# EAGLE design 684-plant-watering (EAGLE 7.4.0)
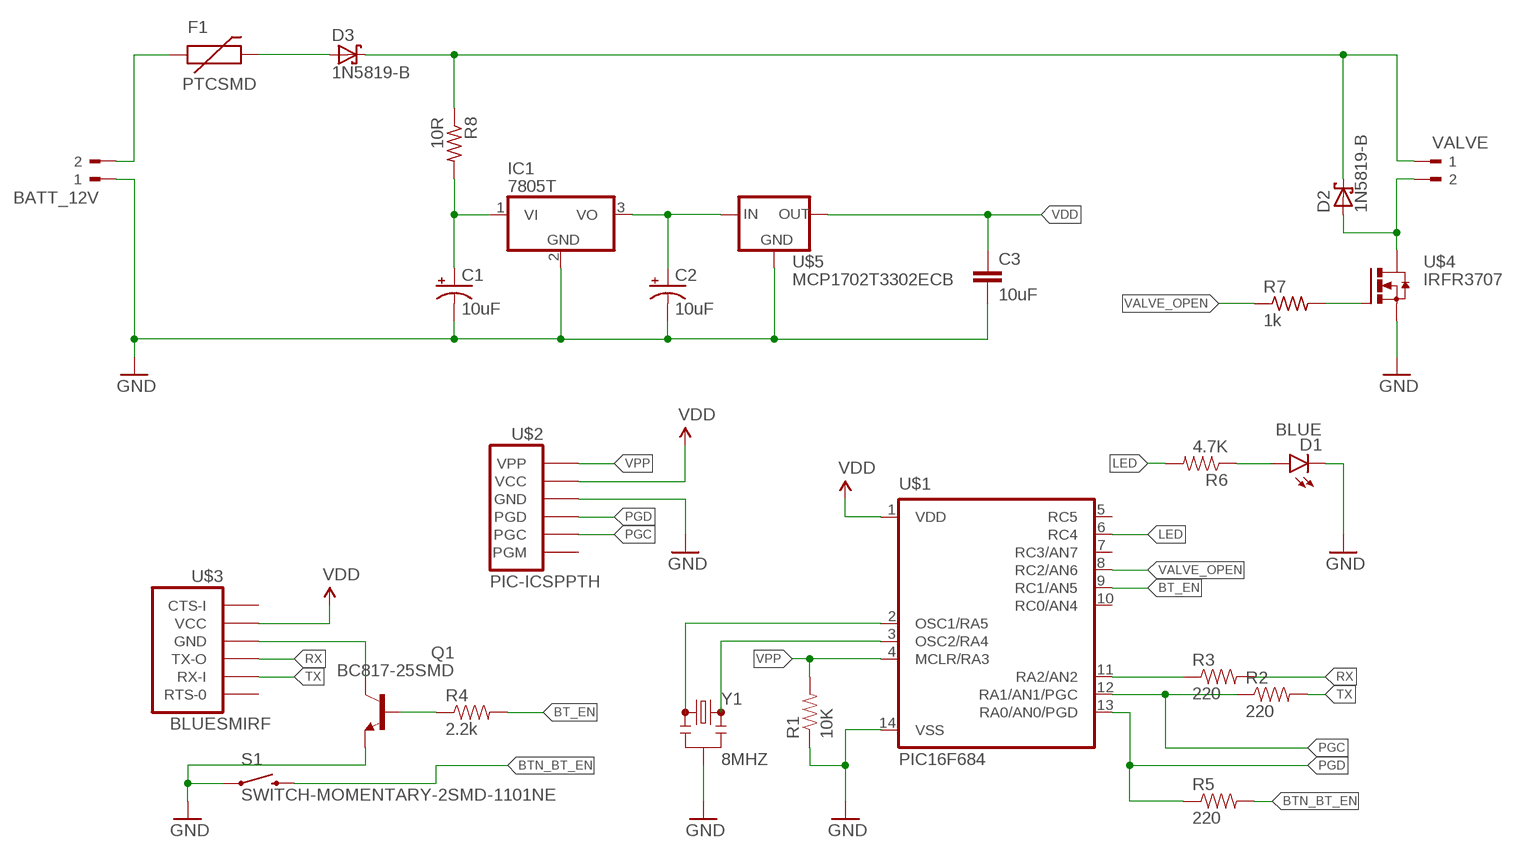
[diagram p0: schematic, sheet 1]

## Parts
BATT_12V  180-2  [180-2]
C1  10uF  10UF-25V-20%(PTH)  [CPOL-RADIAL-10UF-25V]
C2  10uF  10UF-25V-20%(PTH)  [CPOL-RADIAL-10UF-25V]
C3  10uF  10UF-6.3V-20%(0603)  [0603-CAP]
D1  BLUE  LED-BLUE1206  [LED-1206]
D2  1N5819-B  [DO41-7.6]
D3  1N5819-B  [DO41-7.6]
F1  PTCSMD  [PTC-1206]
IC1  7805T  [TO220H]
Q1  BC817-25SMD  [SOT23-BEC]
R1  10K  10KOHM-1/10W-1%(0603)0603  [0603-RES]
R2  220  220OHM-1/10W-1%(0603)  [0603-RES]
R3  220  220OHM-1/10W-1%(0603)  [0603-RES]
R4  2.2k  2.2KOHM-1/10W-1%(0603)  [0603-RES]
R5  220  220OHM-1/10W-1%(0603)  [0603-RES]
R6  4.7K  4.7KOHM-1/10W-1%(0603)  [0603-RES]
R7  1k  R-US_0207/10  [0207/10]
R8  10R  R-US_0309/12  [0309/12]
S1  SWITCH-MOMENTARY-2SMD-1101NE  [TACTILE-SWITCH-1101NE]
U$1  PIC16F684  [SO14]
U$2  PIC-ICSPPTH  [MOLEX-1X6]
U$3  BLUESMIRF  [1X06]
U$4  IRFR3707  [TO252]
U$5  MCP1702T3302ECB  [SOT23]
VALVE  180-2  [180-2]
Y1  8MHZ  RESONATOR8MHZ  [RESONATOR-SMD]

## Nets
BT_EN: R4.2 U$1.9(RC1/AN5)
BTN_BT_EN: R5.2 S1.2
GND: BATT_12V.1 C1.2(-) C2.2(-) C3.2 D1.C IC1.2(GND) Q1.E R1.1 S1.1 U$1.14(VSS) U$2.4(GND) U$4.3(S) U$5.1(GND) Y1.2
LED: R6.2 U$1.6(RC4)
N$1: R3.1 U$1.11(RA2/AN2)
N$2: Q1.C U$3.3(GND)
N$3: Q1.B R4.1
N$4: D1.A R6.1
N$5: D2.A U$4.4(D) VALVE.2
N$6: BATT_12V.2 F1.1
N$7: R7.2 U$4.1(G)
N$8: D2.C D3.C R8.1 VALVE.1
N$9: U$1.2(OSC1/RA5) Y1.1
N$10: C1.1(+) IC1.1(VI) R8.2
N$11: C2.1(+) IC1.3(VO) U$5.3(IN)
N$12: U$1.3(OSC2/RA4) Y1.3
N$13: D3.A F1.2
PGC: R2.1 U$1.12(RA1/AN1/PGC) U$2.2(PGC)
PGD: R5.1 U$1.13(RA0/AN0/PGD) U$2.3(PGD)
RX: R3.2 U$3.4(TX-O)
TX: R2.2 U$3.5(RX-I)
VALVE_OPEN: R7.1 U$1.8(RC2/AN6)
VDD: C3.1 U$1.1(VDD) U$2.5(VCC) U$3.2(VCC) U$5.2(OUT)
VPP: R1.2 U$1.4(MCLR/RA3) U$2.6(VPP)
Unconnected: U$1.5(RC5) U$1.7(RC3/AN7) U$1.10(RC0/AN4) U$2.1(PGM) U$3.1(CTS-I) U$3.6(RTS-0)

## Library data of the parts
BATT_12V VALVE = con-weidmueller-sl35:180-2: WEIDMUELLER CLAMP CONNECTOR; OC_FARNELL: unknown; OC_NEWARK: unknown
C1 C2 = SparkFun-Capacitors:10UF-25V-20%(PTH): CAP-08440; PROD_ID: CAP-08440
C3 = SparkFun-Capacitors:10UF-6.3V-20%(0603): CAP-11015; PROD_ID: CAP-11015
D1 = SparkFun-LED:LED-BLUE: Blue LEDs for production use Various blue LEDs stocked by SparkFun production 0603 - DIO-08575 Rebel - DIO-09553 1206 - DIO-09911; PROD_ID: DIO-09911
D2 D3 = diode:1N581*: 1.0A SCHOTTKY BARRIER RECTIFIER Source: http://www.diodes.com/datasheets/ds23001.pdf
F1 = SparkFun-PowerIC:PTC: Resettable Fuse PTC Resettable Fuse. Spark Fun Electronics SKU : COM-08357; PROD_ID: RES-11150
IC1 = linear:78*: Positive VOLTAGE REGULATOR Source: http://cache.national.com/ds/LM/LM78L05.pdf http://www.fairchildsemi.com/ds/LM/LM7805.pdf
Q1 = transistor-npn:BC817*: NPN Transistor
R1 = SparkFun-Resistors:10KOHM-1/10W-1%(0603): RES-00824; PROD_ID: RES-00824
R2 R3 R5 = SparkFun-Resistors:220OHM-1/10W-1%(0603): RES-07861; PROD_ID: RES-07861
R4 = SparkFun-Resistors:2.2KOHM-1/10W-1%(0603): RES-08272; PROD_ID: RES-08272
R6 = SparkFun-Resistors:4.7KOHM-1/10W-1%(0603): RES-07857; PROD_ID: RES-07857
R7 = resistor:R-US_: RESISTOR, American symbol
R8 = rcl:R-US_: RESISTOR, American symbol
S1 = SparkFun-Electromechanical:SWITCH-MOMENTARY-2: Various NO switches- pushbuttons, reed, etc; PROD_ID: SWCH-00815
U$1 = vbs-lib:PIC16F684
U$2 = SparkFun-Connectors:PIC-ICSP: ISCP Programming connector for UAV, UBW Kit, etc.
U$3 = vbs-lib:BLUESMIRF
U$4 = custom:IRFR3707
U$5 = vbs-lib:MCP1702T3302ECB
Y1 = SparkFun-FreqCtrl:RESONATOR: Resonator Small SMD resonator. Used, eg, on the Arduino Pro/ Pro Mini boards. 8MHz- XTAL-08895 16MHz- XTAL-08900; PROD_ID: XTAL-08895

## Board
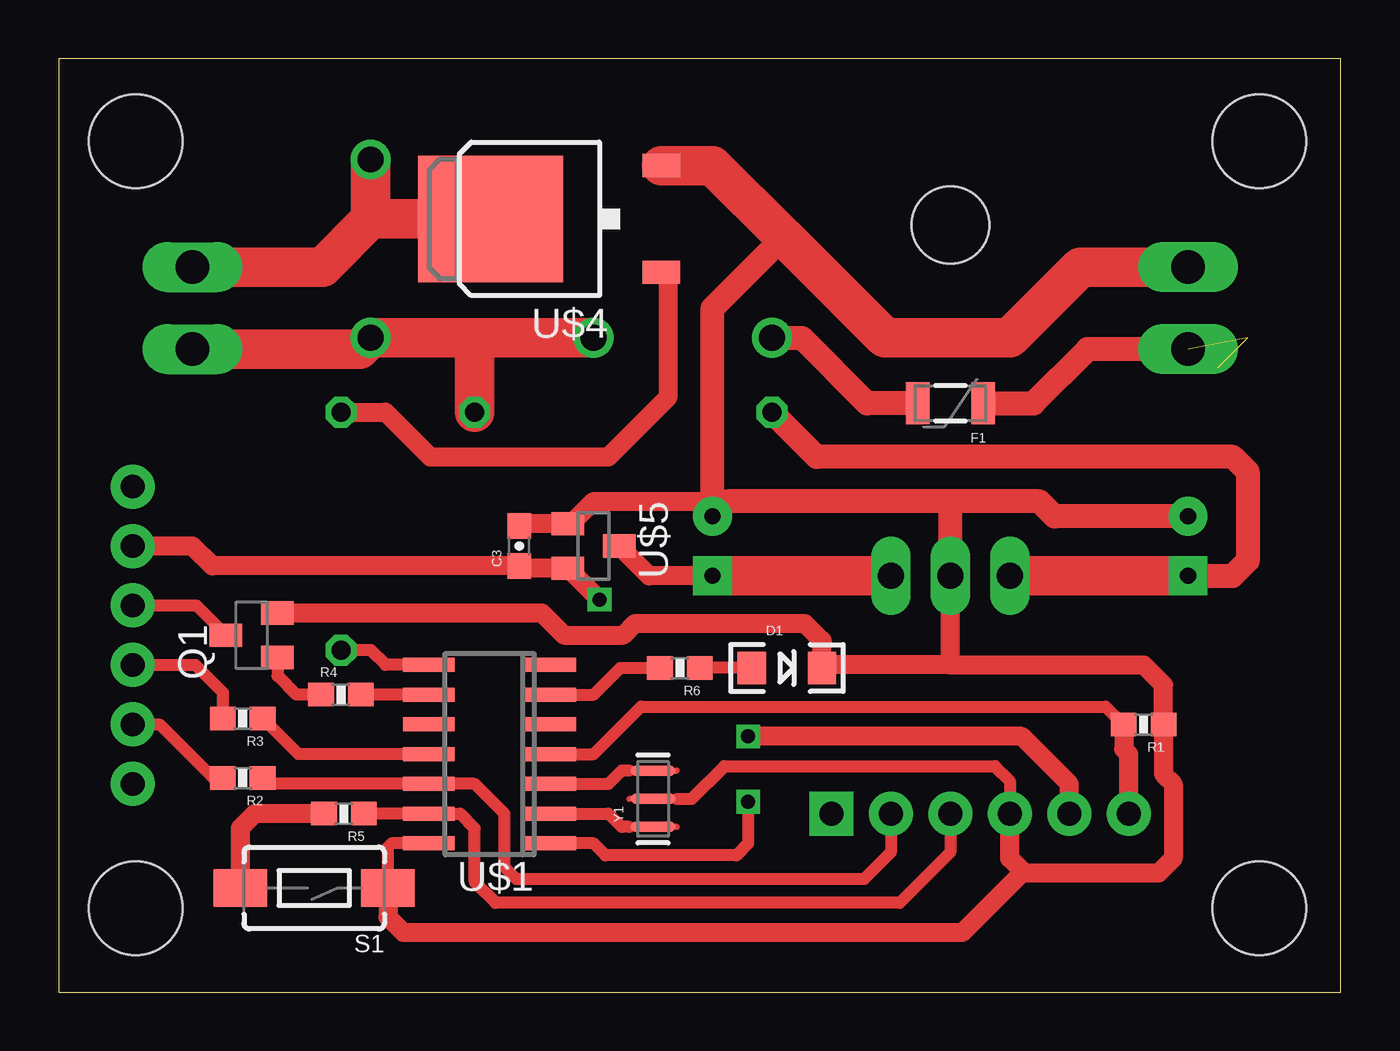
[diagram p1: board, top side]
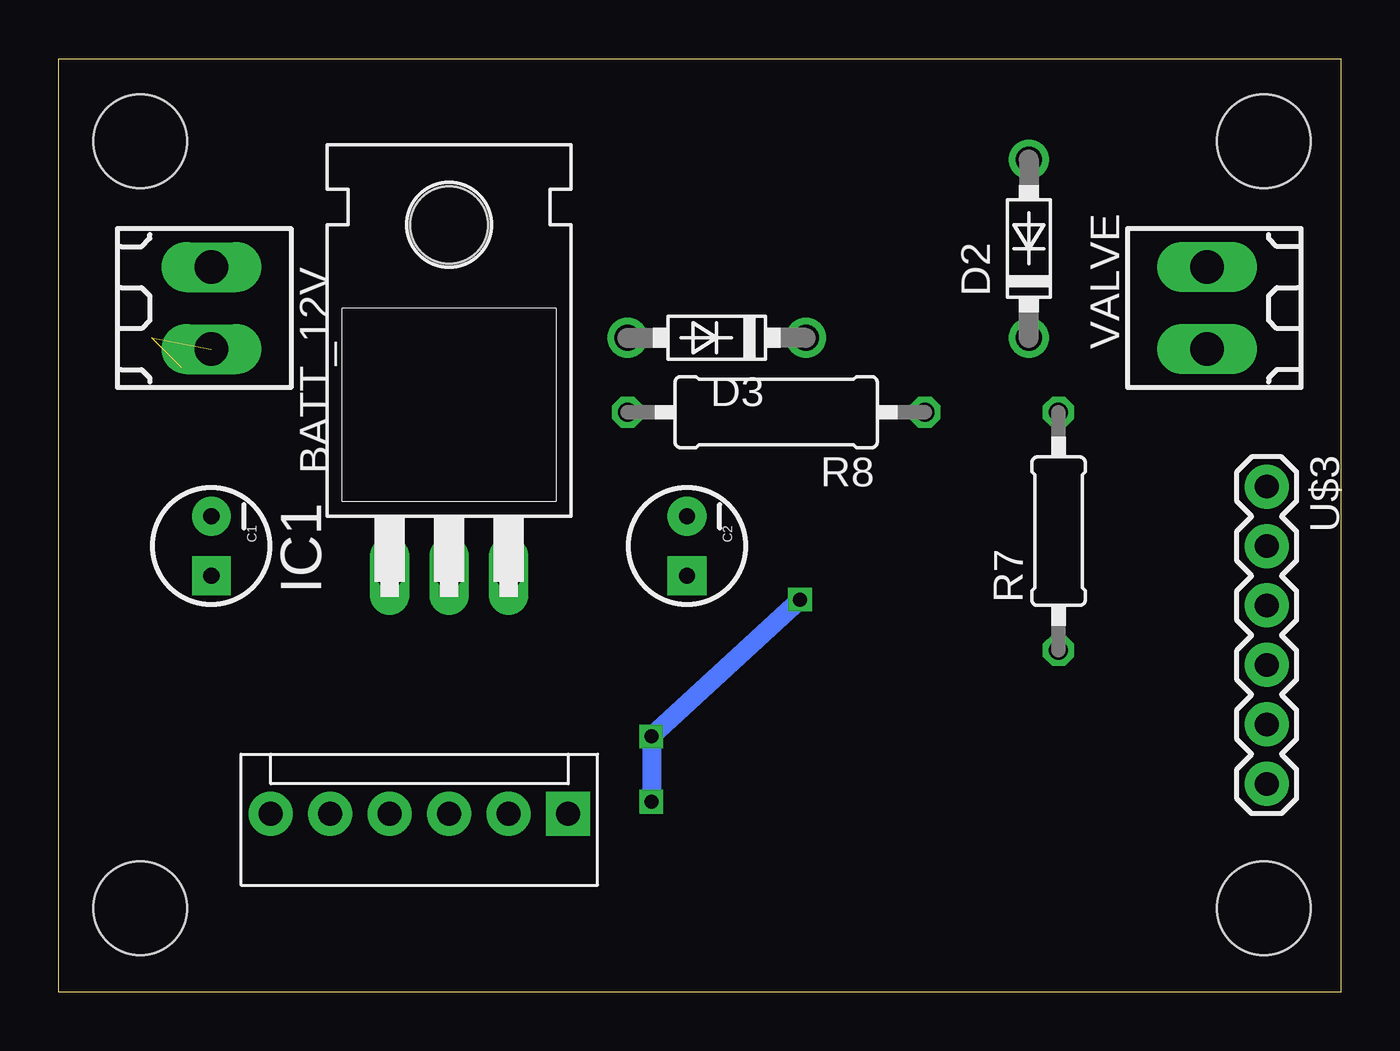
[diagram p2: board, bottom side, seen from below]

Size 54.79 x 39.87 mm. Coordinates in mm from the lower left corner, seen from the top.
Outline: 0,0 54.79,0 54.79,39.87 0,39.87 0,0
Copper layers (1*16): Top 0.035mm / dielectric 1.5mm / Bottom 0.035mm
Design rules "default": minimum track width 10mil, minimum drill 24mil, track to track 8mil, track to pad 8mil, pad to pad 8mil, via to via 8mil, smd to smd 8mil, copper to edge 40mil, drill to drill 8mil, minimum pad ring 10mil, minimum via ring 8mil, stop-mask expansion 4mil, vias tented up to drill 0mil, thermal gap 10mil
Holes 4 mm at 3.3,36.34 3.3,3.57 51.31,3.57 51.31,36.34

### Footprints (pad centres in the part's own frame; a part is rotated, then mirrored left to right if it is on the bottom)
180-2 = drill 1.422 long: 1 -1.75,0; 2 1.75,0
CPOL-RADIAL-10UF-25V = drill 0.7 pad 1.651 square: 1 1.27,0 | drill 0.7 pad 1.651: 2 -1.27,0
0603-CAP = smd 1.1 x 1: 1 -0.85,0; 2 0.85,0
LED-1206 = smd 1.2 x 1.4: A -1.5,0; C 1.5,0
DO41-7.6 = drill 1.1 pad 1.7: A 3.81,0; C -3.81,0
PTC-1206 = smd 1 x 1.8: 1 -1.4,0; 2 1.4,0
TO220H = drill 1.118 long: 1 -2.54,-10.16; 2 0,-10.16; 3 2.54,-10.16 | hole 3.302: 0,4.826
SOT23-BEC = smd 1 x 1.4: B -0.95,-1.1; C 0,1.1; E 0.95,-1.1
0603-RES = smd 1.1 x 1: 1 -0.85,0; 2 0.85,0
0207/10 = drill 0.813 octagon: 1 -5.08,0; 2 5.08,0
0309/12 = drill 0.813 octagon: 1 -6.35,0; 2 6.35,0
TACTILE-SWITCH-1101NE = smd 2.3 x 1.6: 1 -3.15,0; 2 3.15,0
SO14 = smd 0.6 x 2.2: 1 -3.81,-2.6; 2 -2.54,-2.6; 3 -1.27,-2.6; 4 0,-2.6; 5 1.27,-2.6; 6 2.54,-2.6; 7 3.81,-2.6; 8 3.81,2.6; 9 2.54,2.6; 10 1.27,2.6; 11 0,2.6; 12 -1.27,2.6; 13 -2.54,2.6; 14 -3.81,2.6
MOLEX-1X6 = drill 1.016 pad 1.88 square: 1 0,0 | drill 1.016 pad 1.88: 2 2.54,0; 3 5.08,0; 4 7.62,0; 5 10.16,0; 6 12.7,0
1X06 = drill 1.016 pad 1.88: 1 -6.35,0; 2 -3.81,0; 3 -1.27,0; 4 1.27,0; 5 3.81,0; 6 6.35,0
TO252 = smd 1 x 1.6: 1 -2.28,-6.07; 3 2.28,-6.07 | smd 5.4 x 6.2: 4 0,1.23
SOT23 = smd 1 x 1.4: 1 -0.95,-1.1; 2 0.95,-1.1; 3 0,1.1
RESONATOR-SMD = smd 0.45 x 1.905: 1 -1.2,0; 2 0,0; 3 1.2,0

### Placement (x,y rotation side)
BATT_12V  48.26,29.21 270 bottom
C1  48.26,19.05 270 bottom
C2  27.94,19.05 270 bottom
C3  19.68,19.05 90 top
D1  31.11,13.84 0 top
D2  13.34,31.75 90 bottom
D3  26.67,27.94 180 bottom
F1  38.1,25.15 180 top
IC1  38.1,27.94 0 bottom
Q1  8.26,15.24 90 top
R1  46.35,11.43 180 top
R2  7.87,9.14 180 top
R3  7.87,11.68 180 top
R4  12.06,12.7 0 top
R5  12.19,7.62 180 top
R6  26.54,13.84 180 top
R7  12.06,19.68 90 bottom
R8  24.13,24.77 180 bottom
S1  10.92,4.45 180 top
U$1  18.41,10.16 90 top
U$2  33.02,7.62 180 bottom
U$3  3.17,15.24 270 bottom
U$4  19.68,33.02 90 top
U$5  22.86,19.05 270 top
VALVE  5.71,29.21 90 bottom
Y1  25.4,8.26 90 top

### Tracks (layer width: path | path; a pad name or v marks a point on that pad's centre or on a via)
BT_EN
  Top 0.508: U$1.9 R4.2
BTN_BT_EN
  Top 0.813: R5.2 8.38,7.62 7.77,7.01 S1.2
GND
  Top 0.508: 26.42,8.26 27.05,8.26 28.45,9.65 40.01,9.65 40.64,9.02 U$2.4 | U$1.14 14.22,6.35 14.07,6.2 S1.1
  Top 0.813: Q1.E 20.64,16.19 21.59,15.24 24.13,15.24 24.64,15.75 31.88,15.75 32.62,15.01 D1.C 32.74,13.97 38.1,13.97 | 38.1,13.97 IC1.2 | 41.27,5.08 40.64,5.71 U$2.4 | C3.2 19.79,20 U$5.1 21.91,20 22.86,20.95 27.94,20.95 | 38.1,13.97 46.35,13.97 47.2,13.12 R1.1 47.2,9.31 47.62,8.89 47.62,5.71 46.99,5.08 41.27,5.08 | 41.27,5.08 41.15,5.08 38.61,2.54 14.73,2.54 14.07,3.2 S1.1
  Top 1.016: C1.2 42.55,20.32 41.91,20.95 38.1,20.95 | 38.1,20.95 28.57,20.95 C2.2 27.94,20.95 27.94,29.21 30.98,32.26 | IC1.2 38.1,20.95
  Top 1.676: U$4.3 27.94,35.3 30.98,32.26 35.3,27.94 40.64,27.94 43.66,30.96 BATT_12V.1
LED
  Top 0.508: U$1.6 22.86,12.7 24,13.84 R6.2
N$1
  Top 0.508: U$1.11 10.25,10.16 R3.1
N$2
  Top 0.508: U$3.3 5.88,16.51 Q1.C
N$3
  Top 0.508: R4.1 10.16,12.7 9.36,13.51 Q1.B
N$4
  Top 0.508: D1.A R6.1
N$5
  Top 1.676: U$4.4 13.34,33.02 | 13.34,33.02 D2.A | VALVE.2 11.28,30.96 13.34,33.02
N$6  (2 unrouted)
  Top 1.016: F1.1 41.66,25.15 43.97,27.46 BATT_12V.2
N$7
  Top 0.813: U$4.1 25.77,30.74 26.04,30.48 26.04,25.4 23.5,22.86 15.88,22.86 13.97,24.77 R7.2
N$8
  Top 1.676: 17.78,27.94 D2.C 12.86,27.46 VALVE.1 | 17.78,27.94 D3.C | R8.1 17.78,27.94
N$9
  Top 0.508: U$1.2 23.5,7.62 24.06,7.05 24.38,7.05
N$10
  Top 1.016: C1.1 50.16,17.78 50.8,18.41 50.8,22.23 50.16,22.86 32.38,22.86 R8.2
  Top 1.676: C1.1 IC1.1
N$11
  Top 0.813: C2.1 25.23,17.78 U$5.3
  Top 1.676: C2.1 IC1.3
N$12
  Top 0.508: U$1.3 23.5,8.89 24.06,9.46 24.38,9.46
N$13
  Top 1.016: F1.2 34.54,25.15 31.75,27.94 D3.A
PGC
  Top 0.508: U$2.2 35.56,5.97 34.42,4.83 19.56,4.83 19.05,5.33 19.05,7.62 17.78,8.89 U$1.12 8.98,8.89 R2.1
PGD
  Top 0.508: R5.1 U$1.13 17.14,7.62 17.78,6.99 17.78,4.7 18.67,3.81 35.94,3.81 38.1,5.97 U$2.3
RX
  Top 0.508: U$3.4 5.84,13.97 7.02,12.79 R3.2
TX
  Top 0.508: U$3.5 4.32,11.43 6.6,9.14 R2.2
VALVE_OPEN
  Top 0.508: U$1.8 13.97,13.97 13.34,14.61 R7.1
VDD  (via drill 0.6)
  Top 0.508: v29.46,8.13 29.46,6.35 28.96,5.84 23.37,5.84 22.86,6.35 U$1.1
  Top 0.813: U$3.2 5.71,19.05 6.57,18.2 C3.1 19.79,18.1 U$5.2 21.78,18.1 v23.11,16.76 | U$2.5 43.18,8.89 41.15,10.92 v29.46,10.92
  Bottom 0.813: v29.46,8.13 v29.46,10.92 v23.11,16.76
VPP
  Top 0.508: U$1.4 22.86,10.16 24.89,12.19 44.74,12.19 R1.2
  Top 0.813: R1.2 45.51,10.38 45.72,10.16 U$2.6